# Altium project PCB_Project.PrjPcb
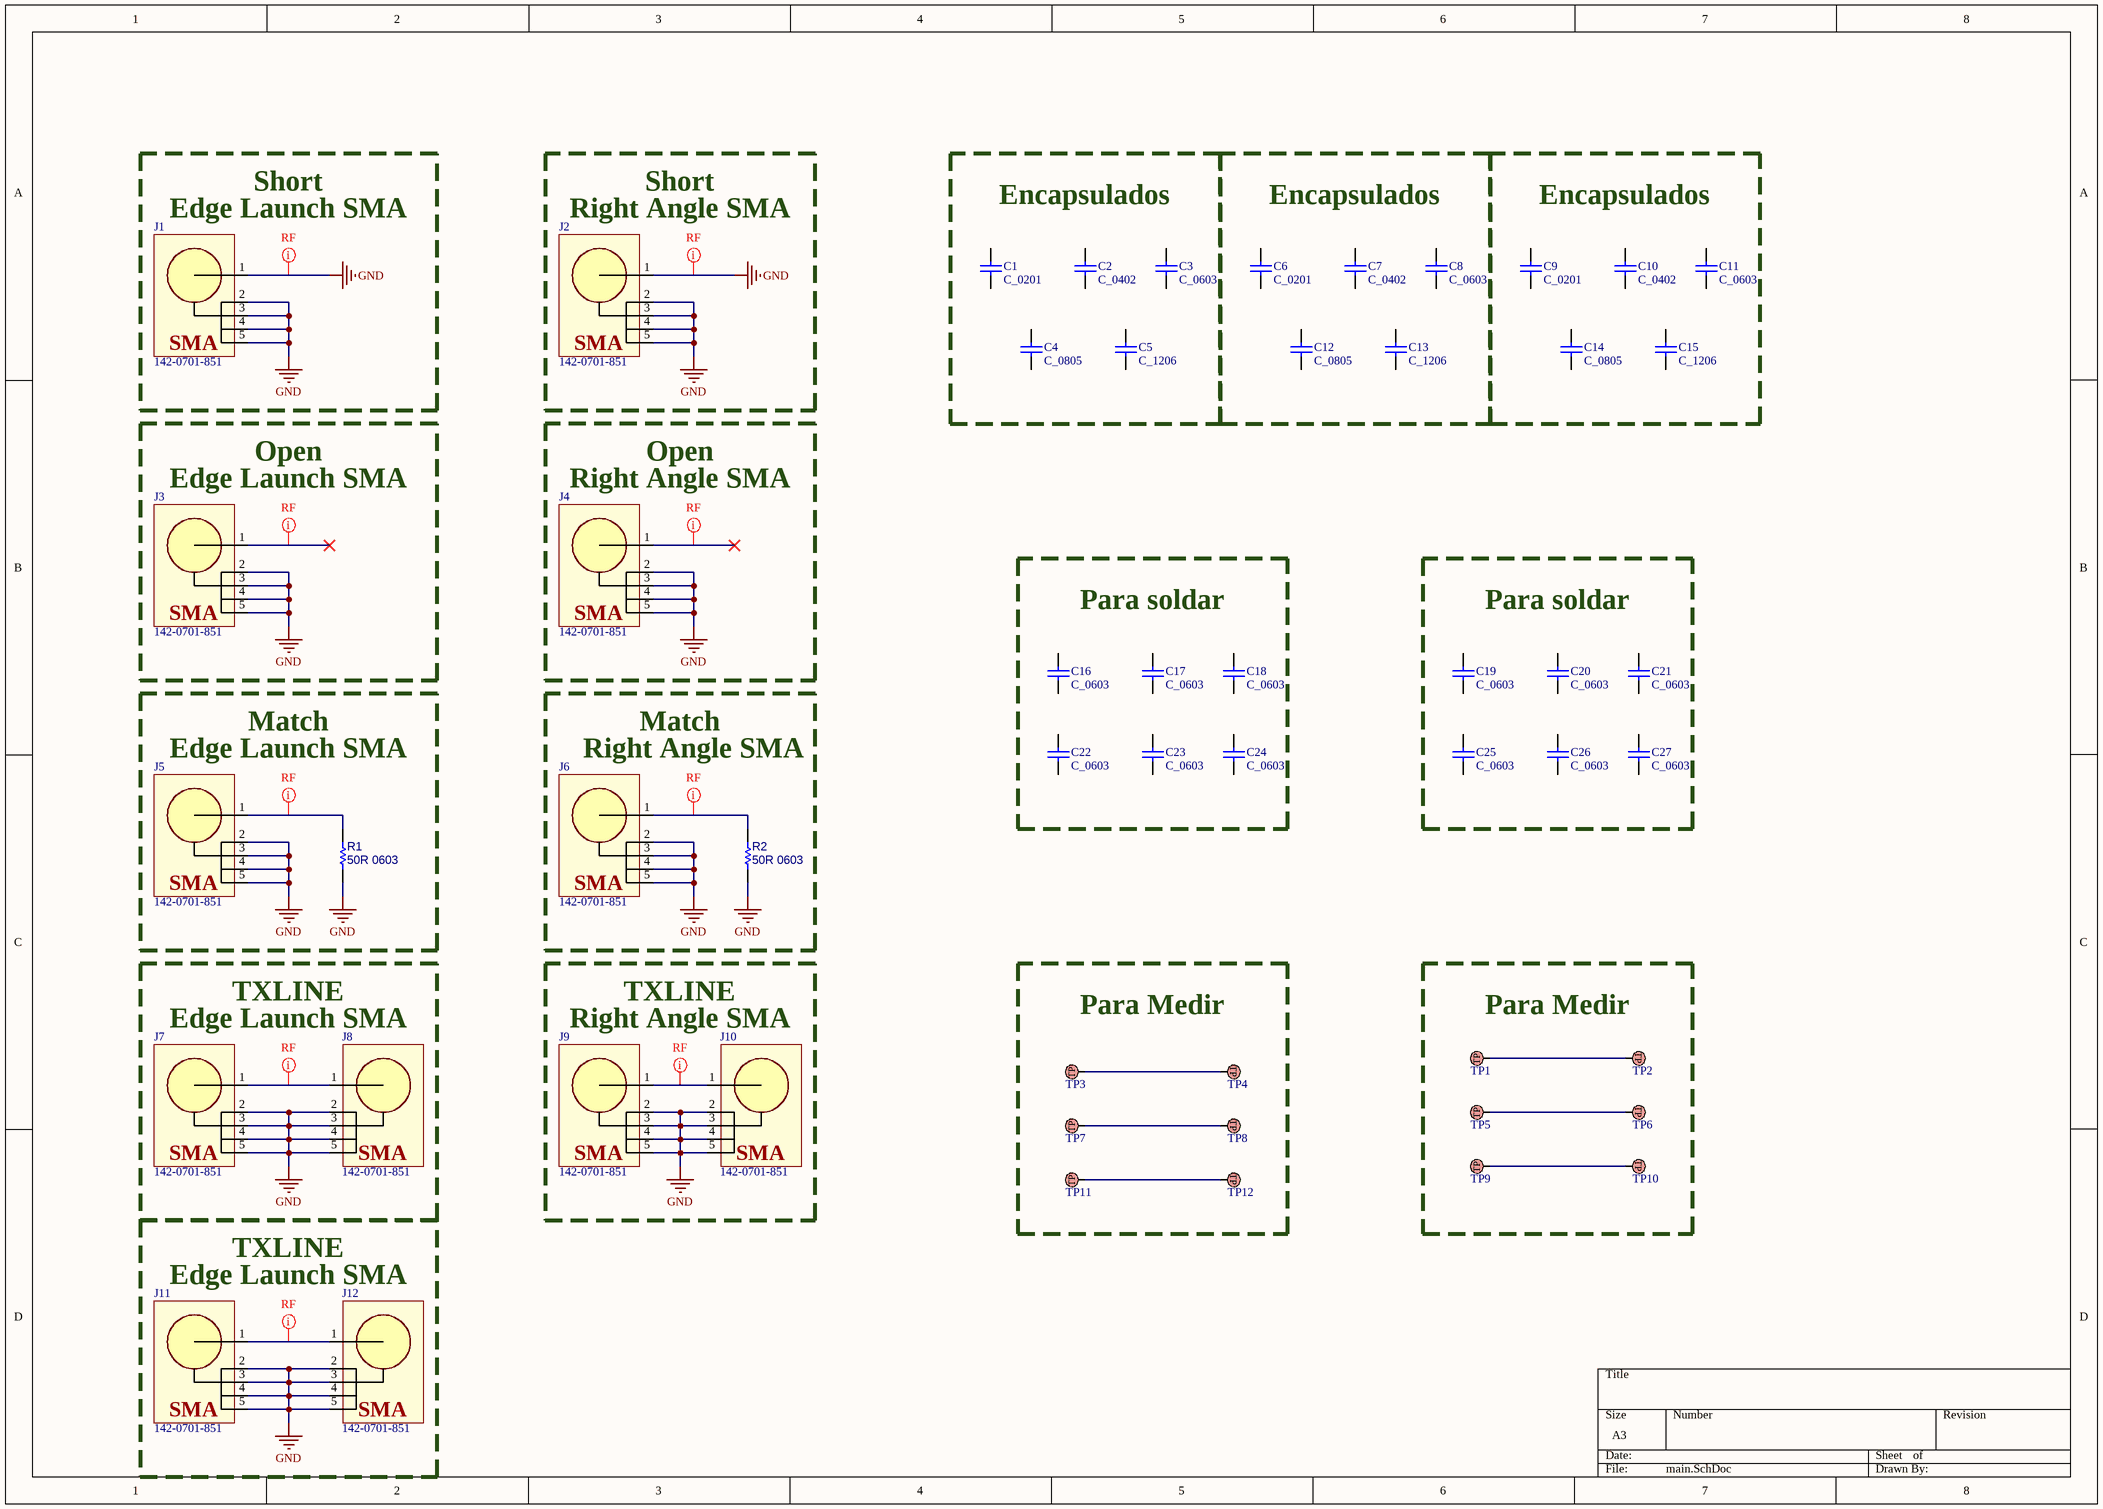
[diagram p0: main.SchDoc]
1 sheet, 53 parts. Net scope: global (net labels, ports and power ports of the same name join across sheets).
Board file: PCB.PcbDoc

## Sheet main.SchDoc
size A3; SheetNumber: 1; SheetTotal: 1

### Parts
C1  C_0201  [C_0201]
C2  C_0402  [C_0402]
C3  C_0603  [C_0603]
C4  C_0805  [C_0805]
C5  C_1206  [C_1206]
C6  C_0201  [C_0201]
C7  C_0402  [C_0402]
C8  C_0603  [C_0603]
C9  C_0201  [C_0201]
C10  C_0402  [C_0402]
C11  C_0603  [C_0603]
C12  C_0805  [C_0805]
C13  C_1206  [C_1206]
C14  C_0805  [C_0805]
C15  C_1206  [C_1206]
C16  C_0603  [C_0603]
C17  C_0603  [C_0603]
C18  C_0603  [C_0603]
C19  C_0603  [C_0603]
C20  C_0603  [C_0603]
C21  C_0603  [C_0603]
C22  C_0603  [C_0603]
C23  C_0603  [C_0603]
C24  C_0603  [C_0603]
C25  C_0603  [C_0603]
C26  C_0603  [C_0603]
C27  C_0603  [C_0603]
J1  142-0701-851  [142-0701-851]
J2  142-0701-851  [142-0701-851]
J3  142-0701-851  [142-0701-851]
J4  142-0701-851  [142-0701-851]
J5  142-0701-851  [142-0701-851]
J6  142-0701-851  [142-0701-851]
J7  142-0701-851  [142-0701-851]
J8  142-0701-851  [142-0701-851]
J9  142-0701-851  [142-0701-851]
J10  142-0701-851  [142-0701-851]
J11  142-0701-851  [142-0701-851]
J12  142-0701-851  [142-0701-851]
R1  50R 0603  [0603[1608]]
R2  50R 0603  [0603[1608]]
TP1  Single Pin Test Point  [testpoint_SMD]  (value not drawn)  (no BOM)
TP2  Single Pin Test Point  [testpoint_SMD]  (value not drawn)  (no BOM)
TP3  Single Pin Test Point  [testpoint_SMD]  (value not drawn)  (no BOM)
TP4  Single Pin Test Point  [testpoint_SMD]  (value not drawn)  (no BOM)
TP5  Single Pin Test Point  [testpoint_SMD]  (value not drawn)  (no BOM)
TP6  Single Pin Test Point  [testpoint_SMD]  (value not drawn)  (no BOM)
TP7  Single Pin Test Point  [testpoint_SMD]  (value not drawn)  (no BOM)
TP8  Single Pin Test Point  [testpoint_SMD]  (value not drawn)  (no BOM)
TP9  Single Pin Test Point  [testpoint_SMD]  (value not drawn)  (no BOM)
TP10  Single Pin Test Point  [testpoint_SMD]  (value not drawn)  (no BOM)
TP11  Single Pin Test Point  [testpoint_SMD]  (value not drawn)  (no BOM)
TP12  Single Pin Test Point  [testpoint_SMD]  (value not drawn)  (no BOM)

### Blocks framed on the sheet
Encapsulados: C1-C5
Encapsulados: C6-C8 C12 C13
Encapsulados: C9-C11 C14 C15
Para soldar: C16-C18 C22-C24
Para soldar: C19-C21 C25-C27
Para Medir: TP3 TP4 TP7 TP8 TP11 TP12
Para Medir: TP1 TP2 TP5 TP6 TP9 TP10

### Nets
GND: J1.1 J1.2 J1.3 J1.4 J1.5 J2.1 J2.2 J2.3 J2.4 J2.5 J3.2 J3.3 J3.4 J3.5 J4.2 J4.3 J4.4 J4.5 J5.2 J5.3 J5.4 J5.5 J6.2 J6.3 J6.4 J6.5 J7.2 J7.3 J7.4 J7.5 J8.2 J8.3 J8.4 J8.5 J9.2 J9.3 J9.4 J9.5 J10.2 J10.3 J10.4 J10.5 J11.2 J11.3 J11.4 J11.5 J12.2 J12.3 J12.4 J12.5 R1.1 R2.1
NetJ5_1: J5.1 R1.2
NetJ6_1: J6.1 R2.2
NetJ7_1: J7.1 J8.1
NetJ9_1: J9.1 J10.1
NetJ11_1: J11.1 J12.1
NetTP1_0: TP1.0 TP2.0
NetTP3_0: TP3.0 TP4.0
NetTP5_0: TP5.0 TP6.0
NetTP7_0: TP7.0 TP8.0
NetTP9_0: TP9.0 TP10.0
NetTP11_0: TP11.0 TP12.0

Not connected (* = marked no-connect by the designer): C1 1 2; C2 1 2; C3 1 2; C4 1 2; C5 1 2; C6 1 2; C7 1 2; C8 1 2; C9 1 2; C10 1 2; C11 1 2; C12 1 2; C13 1 2; C14 1 2; C15 1 2; C16 1 2; C17 1 2; C18 1 2; C19 1 2; C20 1 2; C21 1 2; C22 1 2; C23 1 2; C24 1 2; C25 1 2; C26 1 2; C27 1 2; J3 1*; J4 1*

### Layout directives
net class RF: GND, NetJ3_1, NetJ4_1, NetJ5_1, NetJ6_1, NetJ7_1, NetJ9_1, NetJ11_1

### Notes on the sheet
- Short
- (near J1) Edge Launch SMA
- (near J2) Right Angle SMA
- Open
- (near J3) Edge Launch SMA
- (near J4) Right Angle SMA
- Match
- Edge Launch SMA
- Right Angle SMA
- TXLINE
- (in symbol 142-0701-851) SMA
- (in symbol Testpoint) TP

### Library data of the parts
C1-C27 = Cap: Capacitor; MPN: *; Manufacturer: *; Package: *; Price (USD): *; ComponentLink2Description: SupplierLink; ComponentLink1Description: Datasheet; ComponentLink2URL: *; ComponentLink1URL: *
J1-J12 = 142-0701-851: SMA - Edge Launch - Jack (Socket); ComponentLink1Description: Mouser; ComponentLink1URL: https://ar.mouser.com/ProductDetail/Johnson-Cinch-Connectivity-Solutions/142-0701-851?qs=iKljIZI%252Bxs62lAzRMYOufA%3D%3D; ComponentLink2Description: Datasheet; ComponentLink2URL: https://ar.mouser.com/datasheet/2/643/pi-CCS-JOHN-142-0701-851-1290383.pdf; MPN: 142-0701-851
R1 R2 = Res: Resistor; Manufacturer: *; MPN: *; Package: *; Price (USD): *; ComponentLink1Description: Datasheet; ComponentLink1URL: *; ComponentLink2Description: SupplierLink; ComponentLink2URL: *
TP1-TP12 = Testpoint: ComponentLink1Description: Datasheet; ComponentLink2Description: SupplierLink